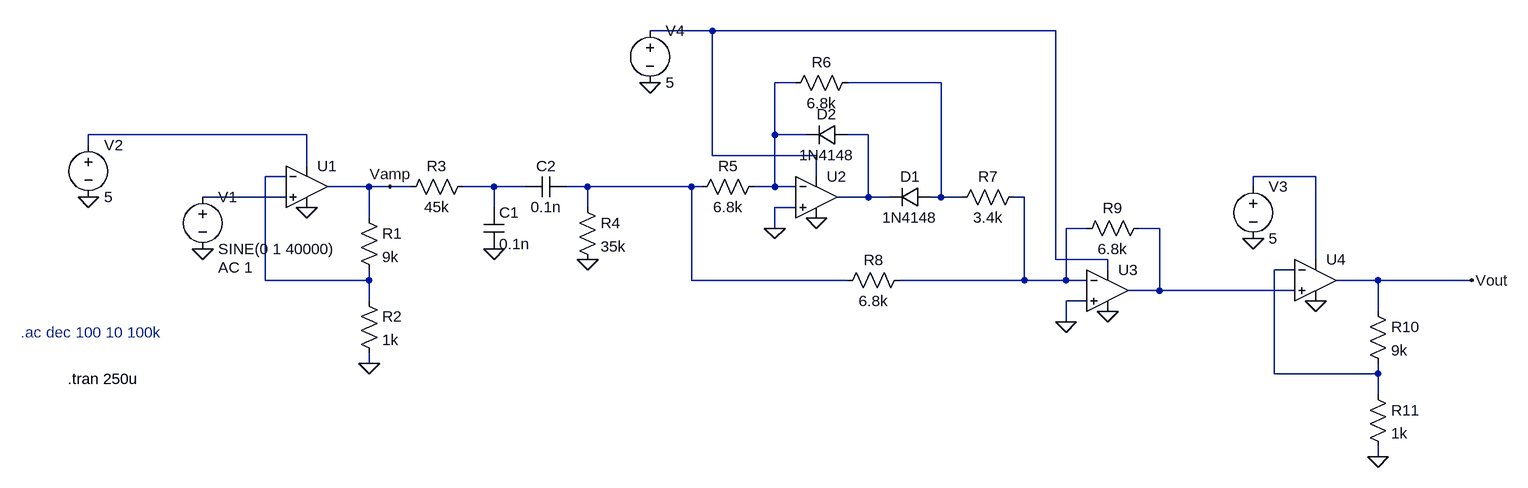
[diagram p0: schematic Ultrasonic Full Circuit.asc]
Ultrasonic Full Circuit.asc, the LTspice schematic file:
Version 4.1
SHEET 1 2228 680
WIRE 848 -160 752 -160
WIRE 1376 -160 848 -160
WIRE 976 -80 944 -80
WIRE 1200 -80 1056 -80
WIRE 224 0 -112 0
WIRE 944 0 944 -80
WIRE 992 0 944 0
WIRE 1088 0 1056 0
WIRE -112 16 -112 0
WIRE 848 32 848 -160
WIRE 1008 32 848 32
WIRE 224 48 224 0
WIRE 192 64 160 64
WIRE 1008 64 1008 32
WIRE 1776 64 1680 64
WIRE 320 80 256 80
WIRE 352 80 320 80
WIRE 384 80 352 80
WIRE 512 80 464 80
WIRE 560 80 512 80
WIRE 656 80 624 80
WIRE 816 80 656 80
WIRE 832 80 816 80
WIRE 944 80 944 0
WIRE 944 80 912 80
WIRE 976 80 944 80
WIRE 1680 80 1680 64
WIRE 192 96 64 96
WIRE 1088 96 1088 0
WIRE 1088 96 1040 96
WIRE 1120 96 1088 96
WIRE 1200 96 1200 -80
WIRE 1200 96 1184 96
WIRE 1232 96 1200 96
WIRE 1328 96 1312 96
WIRE 512 112 512 80
WIRE 656 112 656 80
WIRE 976 112 944 112
WIRE 320 128 320 80
WIRE 944 144 944 112
WIRE 1424 144 1392 144
WIRE 1536 144 1504 144
WIRE 1376 192 1376 -160
WIRE 1456 192 1376 192
WIRE 1776 192 1776 64
WIRE 1456 208 1456 192
WIRE 1744 208 1712 208
WIRE 160 224 160 64
WIRE 320 224 320 208
WIRE 320 224 160 224
WIRE 816 224 816 80
WIRE 1056 224 816 224
WIRE 1328 224 1328 96
WIRE 1328 224 1136 224
WIRE 1392 224 1392 144
WIRE 1392 224 1328 224
WIRE 1424 224 1392 224
WIRE 1872 224 1808 224
WIRE 2016 224 1872 224
WIRE 1536 240 1536 144
WIRE 1536 240 1488 240
WIRE 1744 240 1536 240
WIRE 320 256 320 224
WIRE 1424 256 1392 256
WIRE 1872 272 1872 224
WIRE 1392 288 1392 256
WIRE 320 352 320 336
WIRE 1712 368 1712 208
WIRE 1872 368 1872 352
WIRE 1872 368 1712 368
WIRE 1872 400 1872 368
WIRE 1872 496 1872 480
FLAG 320 352 0
FLAG 64 176 0
FLAG -112 96 0
FLAG 224 112 0
FLAG 656 192 0
FLAG 512 176 0
FLAG 352 80 Vamp
FLAG 944 144 0
FLAG 1008 128 0
FLAG 1392 288 0
FLAG 1456 272 0
FLAG 752 -80 0
FLAG 1872 496 0
FLAG 1776 256 0
FLAG 1680 160 0
FLAG 2016 224 Vout
SYMBOL res 304 112 R0
SYMATTR InstName R1
SYMATTR Value 9k
SYMBOL res 304 240 R0
SYMATTR InstName R2
SYMATTR Value 1k
SYMBOL voltage -112 0 R0
SYMATTR InstName V2
SYMATTR Value 5
SYMBOL OpAmps\\UniversalOpAmp 224 80 R0
SYMATTR InstName U1
SYMBOL res 480 64 R90
WINDOW 0 0 56 VBottom 2
WINDOW 3 32 56 VTop 2
SYMATTR InstName R3
SYMATTR Value 45k
SYMBOL cap 496 112 R0
SYMATTR InstName C1
SYMATTR Value 0.1n
SYMBOL cap 624 64 R90
WINDOW 0 0 32 VBottom 2
WINDOW 3 32 32 VTop 2
SYMATTR InstName C2
SYMATTR Value 0.1n
SYMBOL res 640 96 R0
SYMATTR InstName R4
SYMATTR Value 35k
SYMBOL voltage 64 80 R0
WINDOW 123 24 124 Left 2
WINDOW 39 0 0 Left 0
SYMATTR Value2 AC 1
SYMATTR InstName V1
SYMATTR Value SINE(0 1 40000)
SYMBOL res 928 64 R90
WINDOW 0 0 56 VBottom 2
WINDOW 3 32 56 VTop 2
SYMATTR InstName R5
SYMATTR Value 6.8k
SYMBOL OpAmps\\UniversalOpAmp 1008 96 R0
SYMATTR InstName U2
SYMBOL diode 1184 80 R90
WINDOW 0 0 32 VBottom 2
WINDOW 3 32 32 VTop 2
SYMATTR InstName D1
SYMATTR Value 1N4148
SYMBOL diode 1056 -16 R90
WINDOW 0 0 32 VBottom 2
WINDOW 3 32 32 VTop 2
SYMATTR InstName D2
SYMATTR Value 1N4148
SYMBOL res 1072 -96 R90
WINDOW 0 0 56 VBottom 2
WINDOW 3 32 56 VTop 2
SYMATTR InstName R6
SYMATTR Value 6.8k
SYMBOL res 1328 80 R90
WINDOW 0 0 56 VBottom 2
WINDOW 3 32 56 VTop 2
SYMATTR InstName R7
SYMATTR Value 3.4k
SYMBOL OpAmps\\UniversalOpAmp 1456 240 R0
SYMATTR InstName U3
SYMBOL res 1152 208 R90
WINDOW 0 0 56 VBottom 2
WINDOW 3 32 56 VTop 2
SYMATTR InstName R8
SYMATTR Value 6.8k
SYMBOL res 1520 128 R90
WINDOW 0 0 56 VBottom 2
WINDOW 3 32 56 VTop 2
SYMATTR InstName R9
SYMATTR Value 6.8k
SYMBOL voltage 752 -176 R0
SYMATTR InstName V4
SYMATTR Value 5
SYMBOL res 1856 256 R0
SYMATTR InstName R10
SYMATTR Value 9k
SYMBOL res 1856 384 R0
SYMATTR InstName R11
SYMATTR Value 1k
SYMBOL OpAmps\\UniversalOpAmp 1776 224 R0
SYMATTR InstName U4
SYMBOL voltage 1680 64 R0
SYMATTR InstName V3
SYMATTR Value 5
TEXT -144 376 Left 2 !.tran 250u
TEXT -216 304 Left 2 ;.ac dec 100 10 100k

The netlist it stands for:
* Ultrasonic Full Circuit.asc
R1 Vamp N006 9k
R2 N006 0 1k
V2 N004 0 5
X§U1 N010 N006 N004 0 Vamp level1 Avol=1Meg GBW=10Meg Vos=0 En=0 Enk=0 In=0 Ink=0 Rin=500Meg  ; pins In+ In- V+ V- OUT
R3 N008 Vamp 45k
C1 N008 0 0.1n
C2 N009 N008 0.1n
R4 N009 0 35k
V1 N010 0 SINE(0 1 40000) AC 1
R5 N002 N009 6.8k
X§U2 0 N002 N001 0 N005 level1 Avol=1Meg GBW=10Meg Vos=0 En=0 Enk=0 In=0 Ink=0 Rin=500Meg  ; pins In+ In- V+ V- OUT
D1 N003 N005 1N4148
D2 N005 N002 1N4148
R6 N003 N002 6.8k
R7 N011 N003 3.4k
X§U3 0 N011 N001 0 N012 level1 Avol=1Meg GBW=10Meg Vos=0 En=0 Enk=0 In=0 Ink=0 Rin=500Meg  ; pins In+ In- V+ V- OUT
R8 N011 N009 6.8k
R9 N012 N011 6.8k
V4 N001 0 5
R10 Vout N013 9k
R11 N013 0 1k
X§U4 N012 N013 N007 0 Vout level1 Avol=1Meg GBW=10Meg Vos=0 En=0 Enk=0 In=0 Ink=0 Rin=500Meg  ; pins In+ In- V+ V- OUT
V3 N007 0 5
.model D D
.lib standard.dio
.tran 250u
* .ac dec 100 10 100k
.lib UniversalOpAmp1.lib
.backanno
.end